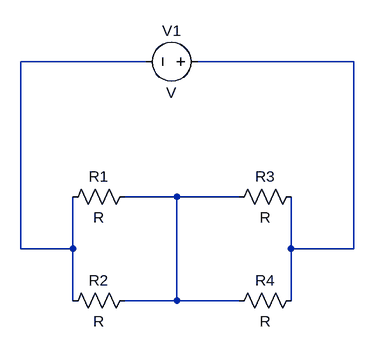
[diagram p0: schematic hw7.asc]
hw7.asc, the LTspice schematic file:
Version 4
SHEET 1 880 680
WIRE 128 -128 -64 -128
WIRE 448 -128 208 -128
WIRE 176 80 96 80
WIRE 272 80 176 80
WIRE -64 160 -64 -128
WIRE 16 160 16 80
WIRE 16 160 -64 160
WIRE 352 160 352 80
WIRE 448 160 448 -128
WIRE 448 160 352 160
WIRE 16 240 16 160
WIRE 176 240 176 80
WIRE 176 240 96 240
WIRE 272 240 176 240
WIRE 352 240 352 160
SYMBOL res 0 96 R270
WINDOW 0 32 56 VTop 2
WINDOW 3 0 56 VBottom 2
SYMATTR InstName R1
SYMBOL res 256 96 R270
WINDOW 0 32 56 VTop 2
WINDOW 3 0 56 VBottom 2
SYMATTR InstName R3
SYMBOL res 0 256 R270
WINDOW 0 32 56 VTop 2
WINDOW 3 0 56 VBottom 2
SYMATTR InstName R2
SYMBOL res 256 256 R270
WINDOW 0 32 56 VTop 2
WINDOW 3 0 56 VBottom 2
SYMATTR InstName R4
SYMBOL voltage 224 -128 R90
WINDOW 0 -32 56 VBottom 2
WINDOW 3 32 56 VTop 2
SYMATTR InstName V1

The netlist it stands for:
* hw7.asc
R1 N001 N003 R
R3 N003 N002 R
R2 N001 N003 R
R4 N003 N002 R
V1 N002 N001 V
.backanno
.end